# Altium schematic sheet Tugas1.SchDoc
size A4; SheetNumber: 1; SheetTotal: 1
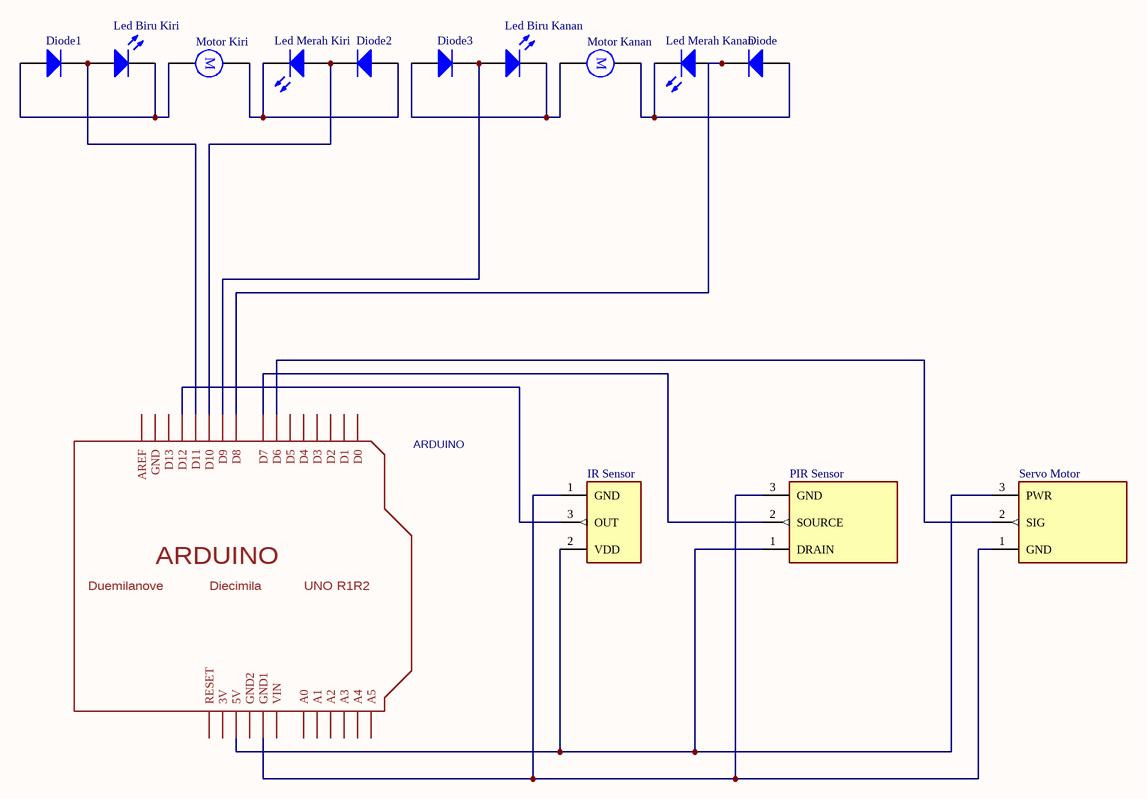
[diagram p0: Tugas1.SchDoc]

## Parts
ARDUINO  (no value)  [ARDUINO]
Diode  (no value)  [SMC]
Diode1  (no value)  [SMC]
Diode2  (no value)  [SMC]
Diode3  (no value)  [SMC]
IR_Sensor  (no value)  [XDCR_TSL260R-LF]
Led_Biru_Kanan  (no value)  [LED-0]
Led_Biru_Kiri  (no value)  [LED-0]
Led_Merah_Kanan  (no value)  [LED-1]
Led_Merah_Kiri  (no value)  [LED-1]
Motor_Kanan  (no value)  [RB5-10.5]
Motor_Kiri  (no value)  [RB5-10.5]
PIR_Sensor  (no value)  [TO254P940H490-3]
Servo_Motor  (no value)  [TO254P940H490-3]

## Nets
NetARDUINO_5V: ARDUINO.5V IR_Sensor.2(VDD) PIR_Sensor.1(DRAIN) Servo_Motor.3(PWR)
NetARDUINO_D6: ARDUINO.D6 Servo_Motor.2(SIG)
NetARDUINO_D7: ARDUINO.D7 PIR_Sensor.2(SOURCE)
NetARDUINO_D8: ARDUINO.D8 Diode.2(K) Led_Merah_Kanan.1(A)
NetARDUINO_D9: ARDUINO.D9 Diode3.2(K) Led_Biru_Kanan.1(A)
NetARDUINO_D10: ARDUINO.D10 Diode2.2(K) Led_Merah_Kiri.1(A)
NetARDUINO_D11: ARDUINO.D11 Diode1.2(K) Led_Biru_Kiri.1(A)
NetARDUINO_D12: ARDUINO.D12 IR_Sensor.3(OUT)
NetARDUINO_GND1: ARDUINO.GND1 IR_Sensor.1(GND) PIR_Sensor.3(GND) Servo_Motor.1(GND)
NetDiode1_1: Diode1.1(A) Led_Biru_Kiri.2(K) Motor_Kiri.2
NetDiode2_1: Diode2.1(A) Led_Merah_Kiri.2(K) Motor_Kiri.1
NetDiode3_1: Diode3.1(A) Led_Biru_Kanan.2(K) Motor_Kanan.2
NetDiode_1: Diode.1(A) Led_Merah_Kanan.2(K) Motor_Kanan.1

Not connected (* = marked no-connect by the designer): ARDUINO 3V A0 A1 A2 A3 A4 A5 AREF D0 D1 D2 D3 D4 D5 D13 GND GND2 RESET VIN

## Notes on the sheet
- (in symbol ARDUINOUNO) Duemilanove; Diecimila; UNO R1R2
- (in symbol Motor) M

## Library data of the parts
ARDUINO = ARDUINOUNO: Contributor: Adafruit; spicePre: U; spiceSymbolName: ARDUINOUNO
Diode Diode1-Diode3 = Diode: Default Diode; Published: 8-Jun-2000; LatestRevisionDate: 17-Jul-2002; LatestRevisionNote: Re-released for DXP Platform.; PackageVersion: Sep-1996; PackageReference: SMC; Publisher: Altium Limited; PackageDescription: DO-214-AB/SMC; 2 C-Bend Leads; Body 7.9 x 5.9 mm, inc. leads (LxW); Code_JEDEC: DO-214-AB
IR_Sensor = TSL260R-LF: Optical Sensor IR 940nm Voltage Radial - 3 Leads; MF: ams; Package: Radial-3 ams; Price: None; SnapEDA_Link: https://www.snapeda.com/parts/TSL260R-LF/ams/view-part/231471/?ref=snap; Availability: Unavailable; Value: *; MP: TSL260R-LF
Led_Biru_Kanan Led_Biru_Kiri = LED0: Typical INFRARED GaAs LED; Published: 8-Jun-2000; LatestRevisionDate: 08-Jul-2005; LatestRevisionNote: Mech Layer 1 removed.; PackageReference: LED-0; Publisher: Altium Limited; PackageDescription: LED; 2 Leads
Led_Merah_Kanan Led_Merah_Kiri = LED1: Typical RED GaAs LED; Published: 8-Jun-2000; LatestRevisionDate: 08-Jul-2005; LatestRevisionNote: Mech Layer 1 removed.; PackageReference: LED-1; Publisher: Altium Limited; PackageDescription: LED; 2 Leads
Motor_Kanan Motor_Kiri = Motor: Motor, General Kind; Published: 24-Mar-1999; LatestRevisionDate: 17-Jul-2002; LatestRevisionNote: Re-released for DXP Platform.; PackageReference: RB5-10.5; Publisher: Altium Limited; PackageDescription: Capacitor (Radial); 2 Leads
PIR_Sensor Servo_Motor = IRA-S210ST01: Sensor PIR _Passive Infrared_ Radial, Metal Can, Lensed - 3 Lead; MF: Murata Electronics; SnapEDA_Link: https://www.snapeda.com/parts/IRA-S210ST01/Murata%20Electronics%20North%20America/view-part/625479/?ref=snap; Value: *; Availability: Unavailable; Price: None; MP: IRA-S210ST01; Package: Radial Murata